# EAGLE design Version1 (EAGLE 6.5.0)
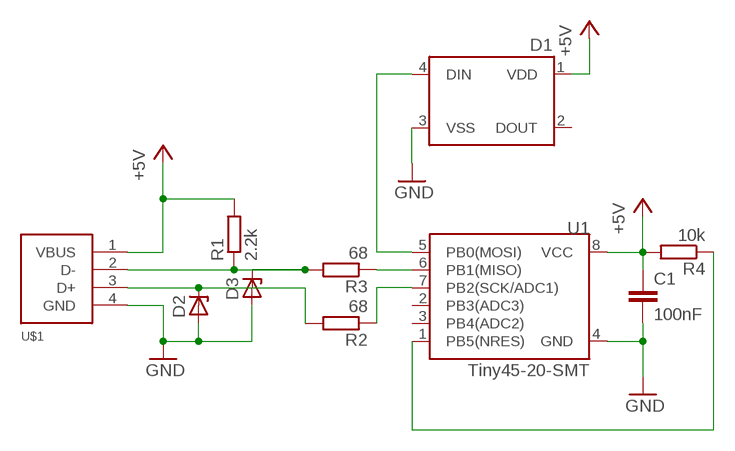
[diagram p0: schematic, sheet 1]

## Parts
C1  100nF  C-EUC0603  [C0603]
D1  WS2812B  [WS2812B]
D2  ZENER-DIODESOD80C  [SOD80C]
D3  ZENER-DIODESOD80C  [SOD80C]
R1  2.2k  R-EU_R0603  [R0603]
R2  68  R-EU_R0603  [R0603]
R3  68  R-EU_R0603  [R0603]
R4  10k  R-EU_R0603  [R0603]
U1  Tiny45-20-SMT  ATTINY45TINY45-20-SMT  [SO08-EIAJ]
U$1  USB-CON-4PIN  [USB-MALE-A-PCB]

## Nets
+5V: C1.1 D1.1(VDD) R1.2 R4.2 U1.8(VCC) U$1.1(VBUS)
GND: C1.2 D1.3(VSS) D2.A D3.A U1.4(GND) U$1.4(GND)
N$1: D3.C R1.1 R3.2 U$1.2(D-)
N$2: D2.C R2.2 U$1.3(D+)
N$3: R3.1 U1.6(PB1(MISO))
N$4: R2.1 U1.7(PB2(SCK/ADC1))
N$5: R4.1 U1.1(PB5(NRES))
N$6: D1.4(DIN) U1.5(PB0(MOSI))
Unconnected: D1.2(DOUT) U1.2(PB3(ADC3)) U1.3(PB4(ADC2))

## Library data of the parts
C1 = rcl:C-EU: CAPACITOR, European symbol
D1 = SparkFun-LED:WS2812B: WS2812B - Intelligent control LED integrated light source Technical Specifications: Power Supply Voltage (VDD): 3.5 to 5.3 V Input Voltage (VI): -0.5 to VDD+0.5 V Operating Junction Temperature (Topt): -25°C to +80°C Storage Temperature Range (Tstg): -55°C to +150°C; PROD_ID: DIO-12503
D2 D3 = diode:ZENER-DIODE: Z-Diode
R1-R4 = rcl:R-EU_: RESISTOR, European symbol
U1 = SparkFun-DigitalIC:ATTINY45: Atmel 8-pin 2/4/8kB flash uC; PROD_ID: IC-08922
U$1 = GeekAmmo:USB-CON-4PIN: USB Connector 4 Pin - No SHIELD

## Board
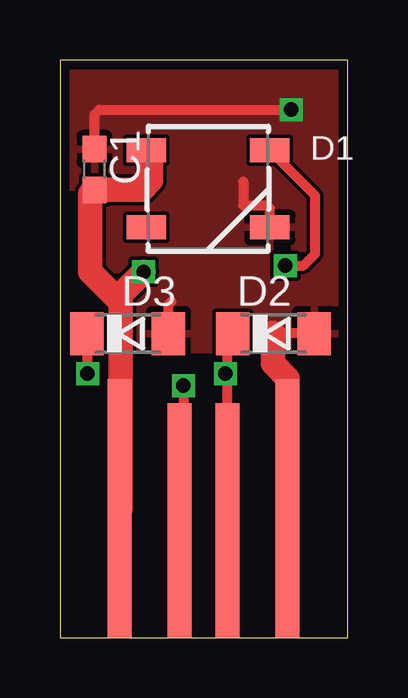
[diagram p1: board, top side]
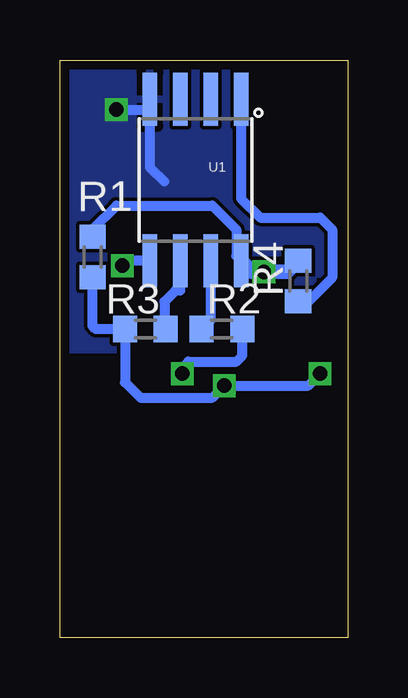
[diagram p2: board, bottom side, seen from below]

Size 12 x 24.07 mm. Coordinates in mm from the lower left corner, seen from the top.
Outline: 0,0 12,0 12,24.07 0,24.07 0,0
Copper layers (1*16): Top 0.0356mm / dielectric 1.5011mm / Bottom 0.0356mm
Design rules "LaenPCBOrder *": minimum track width 6mil, minimum drill 13mil, track to track 6mil, track to pad 6mil, pad to pad 6mil, via to via 6mil, smd to smd 6mil, copper to edge 15mil, drill to drill 6mil, minimum pad ring 7mil, minimum via ring 7mil, stop-mask expansion 3mil, vias tented up to drill 0mil, thermal gap 10mil

### Footprints (pad centres in the part's own frame; a part is rotated, then mirrored left to right if it is on the bottom)
C0603 = smd 1.1 x 1: 1 -0.85,0; 2 0.85,0
WS2812B = smd 1.651 x 1: 1 -2.577,1.6; 2 -2.577,-1.6; 3 2.577,-1.6; 4 2.577,1.6
SOD80C = smd 1.4 x 1.8: A 1.7,0; C -1.7,0
R0603 = smd 1 x 1.1: 1 -0.85,0; 2 0.85,0
SO08-EIAJ = smd 0.61 x 2.21: 1 -1.905,-3.378; 2 -0.635,-3.378; 3 0.635,-3.378; 4 1.905,-3.378; 5 1.905,3.353; 6 0.635,3.353; 7 -0.635,3.353; 8 -1.905,3.353
USB-MALE-A-PCB = smd 1 x 10.76: 1 2.5,5.38; 4 9.5,5.38 | smd 1 x 9.76: 2 5,4.88; 3 7,4.88

### Placement (x,y rotation side)
C1  1.44,19.51 90 top
D1  6.18,18.7 0 top
D2  8.91,12.67 0 top
D3  2.83,12.67 0 top
R1  10.64,15.86 90 bottom
R2  5.25,12.86 0 bottom
R3  8.44,12.86 180 bottom
R4  2.06,14.86 90 bottom
U1  6.35,19.05 180 bottom
U$1  0,0 0 top

### Tracks (layer width: path | path; a pad name or v marks a point on that pad's centre or on a via)
+5V  (via drill 0.6)
  Top 0.406: 3.65,20.25 D1.1
  Top 1.016: U$1.1 2.54,5.38 2.54,13.97 | 2.54,13.97 2.54,14.29 v3.49,15.24 | D1.1 3.81,20.09 3.81,19.05 3.42,18.66 C1.1 1.27,18.49 1.27,15.24 2.54,13.97
  Bottom 0.406: R1.2 10.64,17.01 9.65,18 5.65,18 4.65,17 4.65,15.9 U1.8
  Bottom 0.61: U1.8 3.99,15.24 v3.49,15.24 2.53,15.24 R4.2
GND  (via drill 0.6)
  Top 0.406: 7.65,19 7.65,18 8.65,18 8.76,17.89 D1.3 | C1.2 1.44,21.79 1.65,22 v9.65,22 | 10.15,12.71 D2.A | D3.A 4.53,13.88 4.65,14 | D2.A 10.32,12.67 | 8.89,12.7 10.58,12.7 D2.A
  Top 1.016: U$1.4 9.5,10.82 8.89,11.43 8.89,12.7
  Bottom 0.406: U1.4 8.25,19.61 7.65,19 | v9.65,22 8.15,22
  pour Top: 0,11.99 12.01,11.99 12.01,24.08 0,24.08
  pour Bottom: 0,11.99 12.01,11.99 12.01,24.08 0,24.08
N$1  (via drill 0.6)
  Top 0.406: v1.15,11 1.15,12.65 D3.C | U$1.2 4.9,4.98 4.9,9 5.15,9.25 v5.15,10.5
  Bottom 0.406: R1.1 10.65,13 10.51,12.86 R3.2 9.29,10.64 8.65,10 5.65,10 v5.15,10.5 1.65,10.5 v1.15,11
N$2  (via drill 0.6)
  Top 0.406: U$1.3 7,11 | v6.9,11 7,11 | 7,11 7,12.38 D2.C
  Bottom 0.406: v6.9,11 6.9,11.25 6.65,11.5 4.65,11.5 4.4,11.75 R2.2
N$3
  Bottom 0.406: U1.6 6.98,14.46 7.18,14.46 7.65,14 7.65,12.92 R3.1
N$4
  Bottom 0.406: U1.7 5.71,13.24 R2.1
N$5
  Bottom 0.406: U1.1 4.44,18.3 3.65,17.5 1.15,17.5 0.65,17 0.65,15 1.65,14 R4.1
N$6  (via drill 0.6)
  Top 0.406: v9.4,15.5 10.15,15.5 10.65,16 10.65,18.41 D1.4
  Bottom 0.406: U1.5 9.2,15.7 v9.4,15.5